# EAGLE schematic bbpreamp (EAGLE 9.6.0)
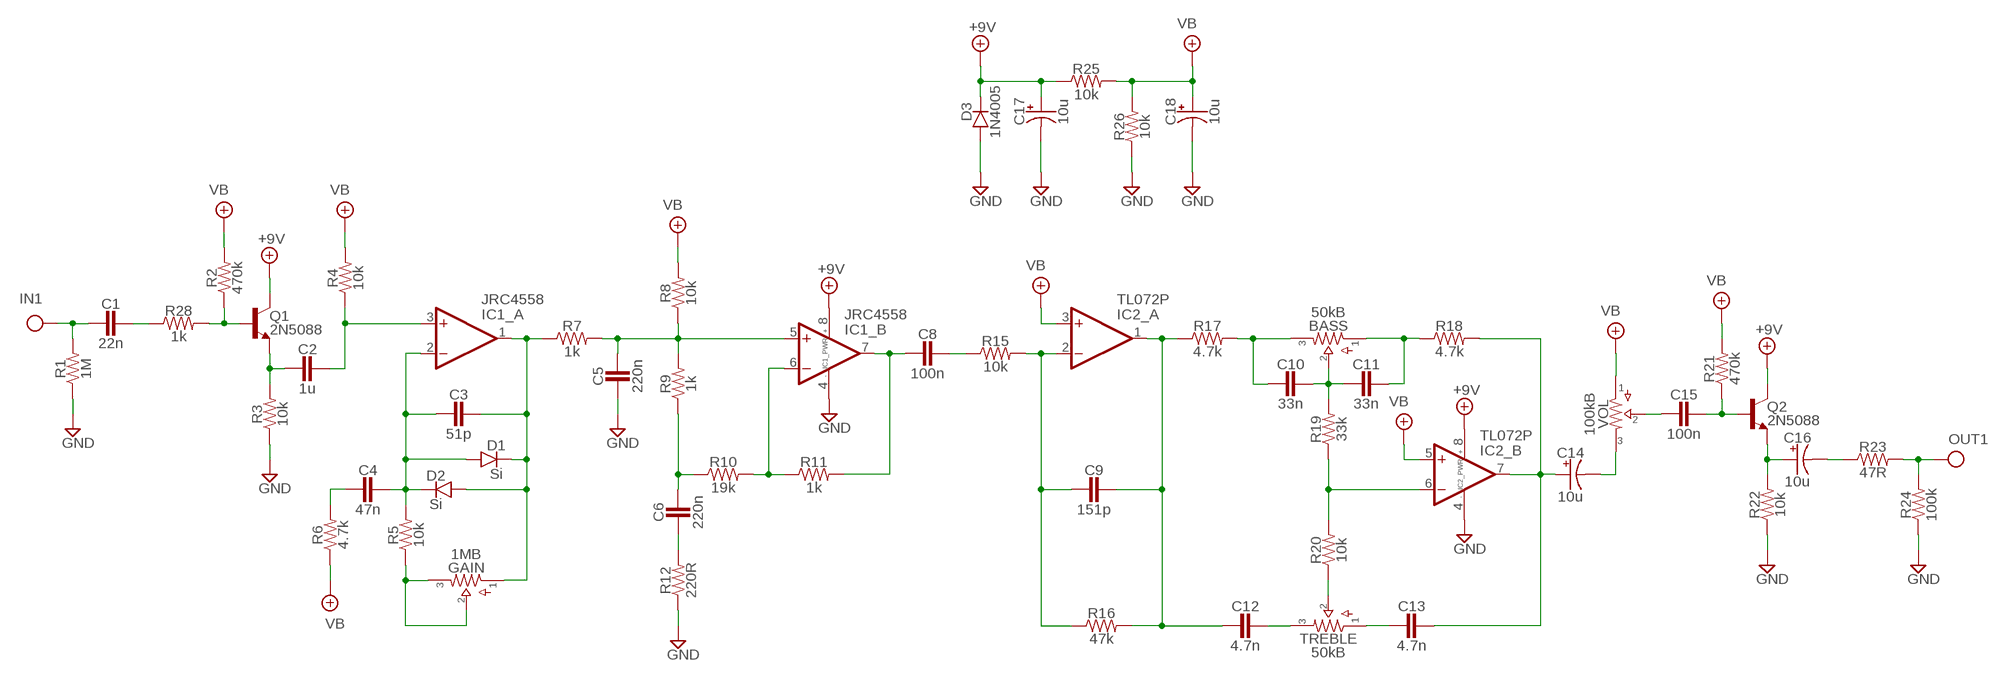
[diagram p0: schematic, sheet 1]

## Parts
BASS  50kB  POTS16MM  [16MM]
C1  22n  CER/FILMBOX.1  [BOX_SMALL]
C2  1u  CER/FILMBOX.1  [BOX_SMALL]
C3  51p  CER/FILMBOX.1  [BOX_SMALL]
C4  47n  CER/FILMBOX.1  [BOX_SMALL]
C5  220n  CER/FILMBOX.1  [BOX_SMALL]
C6  220n  CER/FILMBOX.1  [BOX_SMALL]
C8  100n  CER/FILMBOX.1  [BOX_SMALL]
C9  151p  CER/FILMBOX.1  [BOX_SMALL]
C10  33n  CER/FILMBOX.1  [BOX_SMALL]
C11  33n  CER/FILMBOX.1  [BOX_SMALL]
C12  4.7n  CER/FILMBOX.1  [BOX_SMALL]
C13  4.7n  CER/FILMBOX.1  [BOX_SMALL]
C14  10u  0500  [050_020]
C15  100n  CER/FILMBOX.1  [BOX_SMALL]
C16  10u  0500  [050_020]
C17  10u  0500  [050_020]
C18  10u  0500  [050_020]
D1  Si  DO35.2  [DO35-2]
D2  Si  DO35.2  [DO35-2]
D3  1N4005  DO41.3  [DO41-3]
GAIN  1MB  POTS16MM  [16MM]
IC1  JRC4558  DUALTH  [DIL0]
IC2  TL072P  DUALTH  [DIL0]
Q1  2N5088  [TO92-]
Q2  2N5088  [TO92-]
R1  1M  R_.3B  [R0207/3]
R2  470k  R_.3B  [R0207/3]
R3  10k  R_.3B  [R0207/3]
R4  10k  R_.3B  [R0207/3]
R5  10k  R_.3B  [R0207/3]
R6  4.7k  R_.3B  [R0207/3]
R7  1k  R_.3B  [R0207/3]
R8  10k  R_.3B  [R0207/3]
R9  1k  R_.3B  [R0207/3]
R10  19k  R_.3B  [R0207/3]
R11  1k  R_.3B  [R0207/3]
R12  220R  R_.3B  [R0207/3]
R15  10k  R_.3B  [R0207/3]
R16  47k  R_.3B  [R0207/3]
R17  4.7k  R_.3B  [R0207/3]
R18  4.7k  R_.3B  [R0207/3]
R19  33k  R_.3B  [R0207/3]
R20  10k  R_.3B  [R0207/3]
R21  470k  R_.3B  [R0207/3]
R22  10k  R_.3B  [R0207/3]
R23  47R  R_.3B  [R0207/3]
R24  100k  R_.3B  [R0207/3]
R25  10k  R_.3B  [R0207/3]
R26  10k  R_.3B  [R0207/3]
R28  1k  R_.3B  [R0207/3]
TREBLE  50kB  POTS16MM  [16MM]
VOL  100kB  POTS16MM  [16MM]

## Nets
+9V: C17.+ D3.C IC1.8(_PWR:V+) IC2.8(_PWR:V+) Q1.1(C) Q2.1(C) R25.1
GND: C5.2 C17.- C18.- D3.A IC1.4(_PWR:V-) IC2.4(_PWR:V-) R1.1 R3.1 R12.1 R22.1 R24.1 R26.1
IN: C1.2 R1.2
N$2: C1.1 R28.1
N$3: Q1.2(B) R2.1 R28.2
N$4: C2.2 Q1.3(E) R3.2
N$5: C2.1 IC1.3(_A:+IN) R4.1
N$6: C3.2 C4.1 D1.A D2.C IC1.2(_A:-IN) R5.2
N$7: C3.1 D1.C D2.A GAIN.1 IC1.1(_A:OUT) R7.1
N$8: GAIN.2 GAIN.3 R5.1
N$9: C5.1 IC1.5(_B:+IN) R7.2 R8.1 R9.2
N$10: C4.2 R6.2
N$15: C6.1 R9.1 R10.1
N$16: C6.2 R12.2
N$17: IC1.6(_B:-IN) R10.2 R11.1
N$18: C8.1 R15.1
N$19: C8.2 IC1.7(_B:OUT) R11.2
N$21: C9.2 IC2.2(_A:-IN) R15.2 R16.1
N$22: C9.1 C12.2 IC2.1(_A:OUT) R16.2 R17.1
N$23: C12.1 TREBLE.3
N$24: C13.2 TREBLE.1
N$25: R20.1 TREBLE.2
N$26: BASS.3 C10.2 R17.2
N$27: BASS.1 C11.1 R18.1
N$28: BASS.2 C10.1 C11.2 R19.2
N$29: IC2.6(_B:-IN) R19.1 R20.2
N$30: C13.1 C14.+ IC2.7(_B:OUT) R18.2
N$31: C14.- VOL.3
N$32: C15.2 VOL.2
N$33: C15.1 Q2.2(B) R21.1
N$34: C16.+ Q2.3(E) R22.2
N$35: C16.- R23.1
OUT: R23.2 R24.2
VB: C18.+ IC2.3(_A:+IN) IC2.5(_B:+IN) R2.2 R4.2 R6.1 R8.2 R21.2 R25.2 R26.2 VOL.1

## Library data of the parts
BASS GAIN TREBLE VOL = pedals-potentiometers:POTS
C1-C6 C8-C13 C15 = pedals-capacitors-film:CER/FILM: 47 - 120pF Xicon Ceramic Disc 2.5mm lead spacing
C14 C16-C18 = pedals-capacitors-elec:050
D1 D2 = pedals-diodes:DO35: DO-35 Package Diodes: 1N914
D3 = pedals-diodes:DO41: DO-41 Package Diodes: 1N4001 - 1N40019 Zener Diodes: 1N4728 - 1N4764
IC1 IC2 = pedals-integrated circuits:DUAL: OP AMP
Q1 Q2 = pedals-transistors:2N5088: NPN Transistor
R1-R12 R15-R26 R28 = pedals-resistors:R_